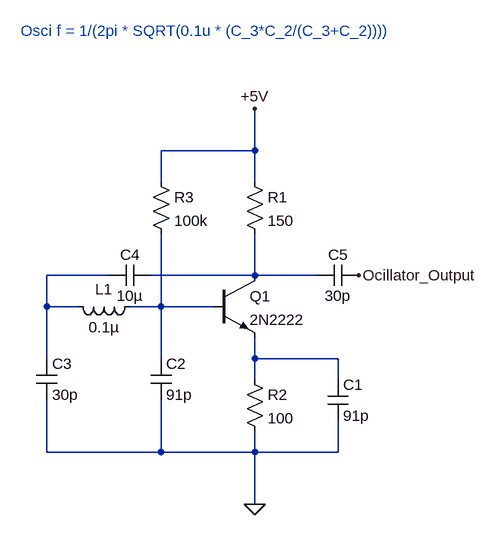
[diagram p0: schematic Oscillator_1.asc]
Oscillator_1.asc, the LTspice schematic file:
Version 4
SHEET 1 880 720
WIRE 480 160 480 96
WIRE 480 160 336 160
WIRE 336 208 336 160
WIRE 480 208 480 160
WIRE 256 352 160 352
WIRE 480 352 480 288
WIRE 480 352 320 352
WIRE 576 352 480 352
WIRE 160 400 160 352
WIRE 208 400 160 400
WIRE 336 400 336 288
WIRE 336 400 288 400
WIRE 416 400 336 400
WIRE 160 480 160 400
WIRE 336 480 336 400
WIRE 480 480 480 448
WIRE 608 480 480 480
WIRE 480 512 480 480
WIRE 608 512 608 480
WIRE 160 624 160 544
WIRE 336 624 336 544
WIRE 336 624 160 624
WIRE 480 624 480 592
WIRE 480 624 336 624
WIRE 608 624 608 576
WIRE 608 624 480 624
WIRE 480 704 480 624
FLAG 480 704 0
FLAG 640 352 Ocillator_Output
FLAG 480 96 +5V
SYMBOL npn 416 352 R0
SYMATTR InstName Q1
SYMATTR Value 2N2222
SYMBOL res 464 192 R0
SYMATTR InstName R1
SYMATTR Value 150
SYMBOL res 464 496 R0
SYMATTR InstName R2
SYMATTR Value 100
SYMBOL res 320 192 R0
SYMATTR InstName R3
SYMATTR Value 100k
SYMBOL cap 592 512 R0
SYMATTR InstName C1
SYMATTR Value 91p
SYMBOL ind 304 384 R90
WINDOW 0 5 56 VBottom 2
WINDOW 3 32 56 VTop 2
SYMATTR InstName L1
SYMATTR Value 0.1µ
SYMBOL cap 320 480 R0
SYMATTR InstName C2
SYMATTR Value 91p
SYMBOL cap 144 480 R0
SYMATTR InstName C3
SYMATTR Value 30p
SYMBOL cap 320 336 R90
WINDOW 0 0 32 VBottom 2
WINDOW 3 32 32 VTop 2
SYMATTR InstName C4
SYMATTR Value 10µ
SYMBOL cap 640 336 R90
WINDOW 0 0 32 VBottom 2
WINDOW 3 32 32 VTop 2
SYMATTR InstName C5
SYMATTR Value 30p
TEXT 120 -24 Left 2 ;Osci f = 1/(2pi * SQRT(0.1u * (C_3*C_2/(C_3+C_2))))

The netlist it stands for:
* Oscillator_1.asc
Q1 N002 N003 N004 0 2N2222
R1 +5V N002 150
R2 N004 0 100
R3 +5V N003 100k
C1 N004 0 91p
L1 N003 N001 0.1µ
C2 N003 0 91p
C3 N001 0 30p
C4 N002 N001 10µ
C5 Ocillator_Output N002 30p
.model NPN NPN
.model PNP PNP
.lib standard.bjt
* Osci f = 1/(2pi * SQRT(0.1u * (C_3*C_2/(C_3+C_2))))
.backanno
.end